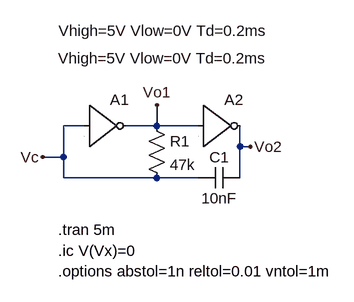
[diagram p0: schematic Multivibrator with Notgate.asc]
Multivibrator with Notgate.asc, the LTspice schematic file:
Version 4.1
SHEET 1 896 680
WIRE 96 144 64 144
WIRE 208 144 208 112
WIRE 208 144 160 144
WIRE 272 144 208 144
WIRE 336 176 336 144
WIRE 352 176 336 176
WIRE 64 192 64 144
WIRE 64 192 32 192
WIRE 64 224 64 192
WIRE 208 224 64 224
WIRE 272 224 208 224
WIRE 336 224 336 176
FLAG 352 176 Vo2
FLAG 208 112 Vo1
FLAG 32 192 Vc
SYMBOL Digital\\inv 96 80 R0
WINDOW 3 -39 -82 Left 2
SYMATTR Value Vhigh=5V Vlow=0V Td=0.2ms
SYMATTR InstName A1
SYMBOL Digital\\inv 272 80 R0
WINDOW 3 -216 -40 Left 2
SYMATTR Value Vhigh=5V Vlow=0V Td=0.2ms
SYMATTR InstName A2
SYMBOL res 192 128 R0
SYMATTR InstName R1
SYMATTR Value 47k
SYMBOL cap 336 208 R90
WINDOW 0 0 32 VBottom 2
WINDOW 3 32 32 VTop 2
SYMATTR InstName C1
SYMATTR Value 10nF
TEXT 56 304 Left 2 !.tran 5m
TEXT 56 336 Left 2 !.ic V(Vx)=0
TEXT 56 368 Left 2 !.options abstol=1n reltol=0.01 vntol=1m

The netlist it stands for:
* Multivibrator with Notgate.asc
A1 Vc 0 0 0 0 Vo1 0 0 BUF Vhigh=5V Vlow=0V Td=0.2ms
A2 Vo1 0 0 0 0 Vo2 0 0 BUF Vhigh=5V Vlow=0V Td=0.2ms
R1 Vo1 Vc 47k
C1 Vo2 Vc 10nF
.tran 5m
.ic V(Vx)=0
.options abstol=1n reltol=0.01 vntol=1m
.backanno
.end